# Altium project Window Comparator - OVP & UVP.PrjPcb
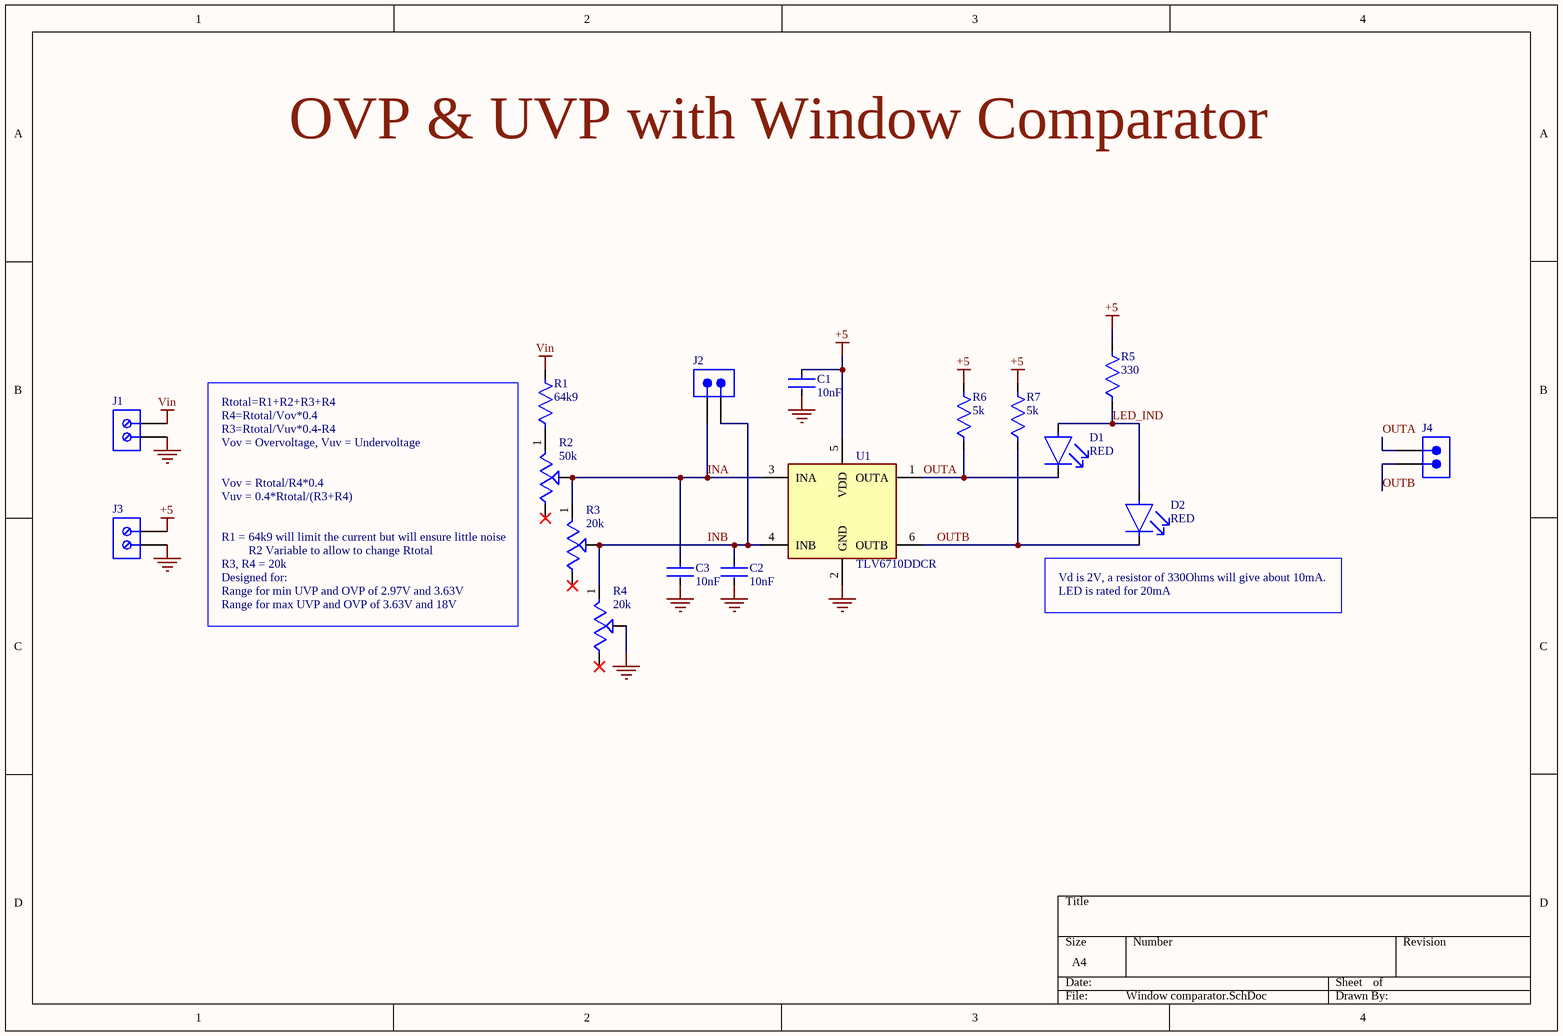
[diagram p0: Window comparator.SchDoc]
1 sheet, 17 parts. Net scope: global (net labels, ports and power ports of the same name join across sheets).
Board file: Window Comparator.PcbDoc

## Sheet Window comparator.SchDoc
size A4; SheetNumber: 1; SheetTotal: 1

### Parts
C1  10nF  [C0805]
C2  10nF  [C0805]
C3  10nF  [C0805]
D1  RED  [LED RED]
D2  RED  [LED RED]
J1  691137710002  [Wire terminal]  (value not drawn)
J2  61300211121  [Pin connector]  (value not drawn)
J3  691137710002  [Wire terminal]  (value not drawn)
J4  61300211121  [Pin connector]  (value not drawn)
R1  64k9  [R0805]
R2  50k  [TS63Y Trimmer]
R3  20k  [TS63Y Trimmer]
R4  20k  [TS63Y Trimmer]
R5  330  [R0805]
R6  5k  [R0805]
R7  5k  [R0805]
U1  TLV6710DDCR  [TLV6710DDCR]

### Nets
+5: C1.1 J3.2 R5.2 R6.2 R7.2 U1.5(VDD)
GND: C1.2 C2.2 C3.2 J1.1 J3.1 R4.2(B) U1.2(GND)
Vin: J1.2 R1.2
INA: C3.1 J2.1 R2.2(B) R3.1(A) U1.3(INA)
INB: C2.1 J2.2 R3.2(B) R4.1(A) U1.4(INB)
LED_IND: D1.2(A) D2.2(A) R5.1
OUTA: D1.1(C) J4.1 R6.1 U1.1(OUTA)
OUTB: D2.1(C) J4.2 R7.1 U1.6(OUTB)
NetR1_1: R1.1 R2.1(A)

Not connected (* = marked no-connect by the designer): R2 3(C)*; R3 3(C)*; R4 3(C)*

### Notes on the sheet
- OVP & UVP with Window Comparator
- Rtotal=R1+R2+R3+R4
- R4=Rtotal/Vov*0.4
- Vov = Overvoltage, Vuv = Undervoltage
- R3=Rtotal/Vuv*0.4-R4
- Vov = Rtotal/R4*0.4
- Vuv = 0.4*Rtotal/(R3+R4)
- (near R3) R1 = 64k9 will limit the current but will ensure little noise
- R3, R4 = 20k
- Designed for:
- R2 Variable to allow to change Rtotal
- (near D2) Vd is 2V, a resistor of 330Ohms will give about 10mA.
- Range for min UVP and OVP of 2.97V and 3.63V
- Range for max UVP and OVP of 3.63V and 18V
- LED is rated for 20mA

### Library data of the parts
C1-C3 = C0805C103K5RECAUTO: Ceramic Capacitor, Multilayer, Ceramic, 50V, 10% +Tol, 10% -Tol, X7R, 15% TC, 0.01uF, Surface Mount, 0805; Manufacturer: KEMET; Supplier: Newark; Supplier Part Number: 76AH8705; Manufacturer Part Number: C0805C103K5RECAUTO; RoHS: Yes; Category: Ceramic Capacitors; Stock: 500; Pricing: 1=0.015, 25=0.015, 50=0.015 (USD); Pins: 2; Dielectric Material: Ceramic; Capacitor Type: Ceramic; Reach SVHC Compliant: Yes; RoHS Compliant: Yes; ComponentLink1URL: https://datasheet.ciiva.com:443/pdfs/VipMasterIC/IC/KEME/KEME-S-A0008958450/KEME-S-A0008958450-1.pdf?src-supplier=IHS+Markit; ComponentLink1Description: https://datasheet.ciiva.com:443/pdfs/VipMasterIC/IC/KEME/KEME-S-A0008958450/KEME-S-A0008958450-1.pdf?src-supplier=IHS+Markit; ComponentLink2URL: http://www.farnell.com/datasheets/2723804.pdf?src-supplier=Farnell; ComponentLink2Description: http://www.farnell.com/datasheets/2723804.pdf?src-supplier=Farnell; ComponentLink3URL: https://api.kemet.com/component-edge/download/datasheet/C0805C103K5RECAUTO.pdf?src-supplier=Digikey; ComponentLink3Description: https://api.kemet.com/component-edge/download/datasheet/C0805C103K5RECAUTO.pdf?src-supplier=Digikey; ComponentLink4URL: http://www.farnell.com/datasheets/2723804.pdf?src-supplier=Newark; ComponentLink4Description: http://www.farnell.com/datasheets/2723804.pdf?src-supplier=Newark
D1 D2 = VLMS1300-GS08: Single Color LED, Super Red, 1.1mm; Manufacturer: Vishay Semiconductors; Shape: Rectangular; Additional Feature: HIGH RELIABILITY; Forward Current: 30mA; Forward Voltage: 2.4V; Luminous Intensity-Nom: 54mcd; Channels: 1; Reverse Voltage-Max: 5V; Viewing Angle: 130°; Overall Height: 0.8mm; Supplier: Mouser; Supplier Part Number: 78-VLMS1300-GS08; Manufacturer Part Number: VLMS1300-GS08; RoHS: Yes; Category: LEDs; Stock: 39915; Pricing: 1=0.27, 10=0.217, 50=0.217, 100=0.091, 1000=0.075, 10000=0.052 (USD); Mounting Technology: Surface Mount; Pins: 2; Color: Red; Color@wavelength: Red; Min Operating Temperature: -35°C; Max Operating Temperature: 85°C; Optoelectronic Device Type: SINGLE COLOR LED; Packaging: Tape and Reel; Size: 1.1mm; Terminal Pitch: 1.5mm; Reach SVHC Compliant: Yes; RoHS Compliant: Yes; ComponentLink1URL: https://datasheet.ciiva.com:443/pdfs/VipMasterIC/IC/VISH/VISH-S-A0004564149/VISH-S-A0004564149-1.pdf?src-supplier=IHS+Markit; ComponentLink1Description: https://datasheet.ciiva.com:443/pdfs/VipMasterIC/IC/VISH/VISH-S-A0004564149/VISH-S-A0004564149-1.pdf?src-supplier=IHS+Markit; ComponentLink2URL: https://datasheet.ciiva.com/26322/vlmo1300-26322153.pdf?src-supplier=Element14; ComponentLink2Description: https://datasheet.ciiva.com/26322/vlmo1300-26322153.pdf?src-supplier=Element14; ComponentLink3URL: https://datasheet.ciiva.com/8028/vlmo1300-8028047.pdf?src-supplier=Element14; ComponentLink3Description: https://datasheet.ciiva.com/8028/vlmo1300-8028047.pdf?src-supplier=Element14; ComponentLink4URL: https://datasheet.ciiva.com/9333/vlmo1300-9333743.pdf?src-supplier=Avnet; ComponentLink4Description: https://datasheet.ciiva.com/9333/vlmo1300-9333743.pdf?src-supplier=Avnet; ComponentLink5URL: https://datasheet.ciiva.com/16510/vlmo1300-16510985.pdf?src-supplier=Future+Electronics; ComponentLink5Description: https://datasheet.ciiva.com/16510/vlmo1300-16510985.pdf?src-supplier=Future+Electronics
J1 J3 = 691137710002: Barrier Strip Terminal Block; Manufacturer: Wurth Electronics; Supplier: Rs; Supplier Part Number: 1770020; Manufacturer Part Number: 691137710002; RoHS: No; Category: Terminal Blocks; Stock: 15; Pricing: 5=0.374, 25=0.336, 50=0.306, 100=0.28, 250=0.26 (EUR); RoHS Compliant: Yes; ComponentLink1URL: https://datasheet.ciiva.com:443/pdfs/VipMasterIC/IC/MIDC/MIDC-S-A0005074262/MIDC-S-A0004711666-1.pdf?src-supplier=IHS+Markit; ComponentLink1Description: https://datasheet.ciiva.com:443/pdfs/VipMasterIC/IC/MIDC/MIDC-S-A0005074262/MIDC-S-A0004711666-1.pdf?src-supplier=IHS+Markit; ComponentLink2URL: https://katalog.we-online.de/em/datasheet/691137710002.pdf?src-supplier=Digikey; ComponentLink2Description: https://katalog.we-online.de/em/datasheet/691137710002.pdf?src-supplier=Digikey
J2 J4 = 61300211121: Board Connector, 2 Contact(s), 1 Row(s), Male, Straight, 0.1 inch Pitch, Solder Terminal, Locking, Black Insulator, Plug; Manufacturer: Wurth Electronics; Option: General Purpose; Contact Pattern: RECTANGULAR; Contact Resistance: 20mR; Contact Style: SQ PIN-SKT; Dielectric Withstanding Voltage (AC): 500V; Filter Feature: No; Insulation Resistance: 1GR; Number Of Connectors: 1; Rated Current (Signal): 3A; Number of Contacts: 2; Body Length: 0.2inch; Reference Standard: UL; Reliability: COMMERCIAL; Supplier: Rs; Supplier Part Number: 1725138; Manufacturer Part Number: 61300211121; RoHS: Yes; Category: Headers and Wire Housings; Stock: 2265; Pricing: 1000=0.063 (EUR); Mounting Technology: Board; Contact Material: Copper Alloy; Contact Finish - Mating: GOLD; Contact Finish - Termination: Gold (Au) - with Nickel (Ni) barrier; Insulation Color: Black; Insulation Material: Polybutylene; Min Operating Temperature: -40°C; Max Operating Temperature: 125°C; Connector Type: BOARD CONNECTOR; JESD-609 Code: e4; Body/Shell Style: PLUG; Contact Gender: Male; Mixed Contacts: No; Mounting Style: STRAIGHT; Number of Rows Loaded: 1; PCB Contact Pattern: RECTANGULAR; Termination: Solder; Body Breadth: 0.1inch; Body Depth: 0.1inch; Mating Contact Pitch: 0.1inch; Mounting Option 1: LOCKING; Terminal Length: 0.118inch; Terminal Pitch: 2.54mm; Flammability Rating: UL94 V-0; Reach SVHC Compliant: Yes; RoHS Compliant: Yes; DIN Conformance: No; IEC Conformance: No; MIL Conformance: No; ComponentLink1URL: https://datasheet.ciiva.com:443/pdfs/VipMasterIC/IC/MIDC/MIDCS07676/MIDCS07676-1.pdf?src-supplier=IHS+Markit; ComponentLink1Description: https://datasheet.ciiva.com:443/pdfs/VipMasterIC/IC/MIDC/MIDCS07676/MIDCS07676-1.pdf?src-supplier=IHS+Markit; ComponentLink2URL: https://datasheet.ciiva.com/13619/6130xx11121-48870-13619345.pdf?src-supplier=Mouser; ComponentLink2Description: https://datasheet.ciiva.com/13619/6130xx11121-48870-13619345.pdf?src-supplier=Mouser
R1 = CRCW080564K9FKEA: Fixed Resistor, Metal Glaze/thick Film, 0.125W, 64900ohm, 150V, 1% +/-Tol, 100ppm/Cel, Surface Mount, 0805; Manufacturer: Vishay; Power: 125mW; Rated Temperature: 70°C; Value: 64.9kR; Temperature Coefficient: 100ppm/°C; Package Height: 0.45mm; Package Length: 2mm; Package Width: 1.25mm; Reference Standard: AEC-Q200; Supplier: Future Electronics; Supplier Part Number: 5035246; Manufacturer Part Number: CRCW080564K9FKEA; RoHS: Yes; Category: Chip SMD Resistors; Stock: 15000; Pricing: 5000=0.0061, 20000=0.0059, 75000=0.0056, 150000=0.0055, 375000=0.0052 (USD); Mounting Technology: Surface Mount; Pins: 2; Package Shape: Rectangular; Case/Package: 0805; Terminal Finish: Nickel; Min Operating Temperature: -55°C; Max Operating Temperature: 155°C; Tolerance: 1%; JESD-609 Code: e3; Resistor Type: FIXED RESISTOR; Construction: Chip; Package Style: SMTMeter; Packaging: Tape and Reel; Technology: METAL GLAZE/THICK FILM; Termination: Wraparound; Working Voltage: 150V; Reach SVHC Compliant: Yes; RoHS Compliant: Yes; ComponentLink1URL: https://datasheet.ciiva.com:443/pdfs/VipMasterIC/IC/VISH/VISH-S-A0007266705/VISH-S-A0007266705-1.pdf?src-supplier=IHS+Markit; ComponentLink1Description: https://datasheet.ciiva.com:443/pdfs/VipMasterIC/IC/VISH/VISH-S-A0007266705/VISH-S-A0007266705-1.pdf?src-supplier=IHS+Markit; ComponentLink2URL: https://datasheet.ciiva.com/7726/66915-7726047.pdf?src-supplier=Element14; ComponentLink2Description: https://datasheet.ciiva.com/7726/66915-7726047.pdf?src-supplier=Element14; ComponentLink3URL: https://datasheet.ciiva.com/8994/dcrcwe3-8994359.pdf?src-supplier=Avnet; ComponentLink3Description: https://datasheet.ciiva.com/8994/dcrcwe3-8994359.pdf?src-supplier=Avnet; ComponentLink4URL: https://datasheet.ciiva.com/5547/dcrcwe3-109170-5547542.pdf?src-supplier=Mouser; ComponentLink4Description: https://datasheet.ciiva.com/5547/dcrcwe3-109170-5547542.pdf?src-supplier=Mouser; ComponentLink5URL: https://datasheet.ciiva.com/16776/70201119-16776154.pdf?src-supplier=Allied+Electronics; ComponentLink5Description: https://datasheet.ciiva.com/16776/70201119-16776154.pdf?src-supplier=Allied+Electronics; ComponentLink6URL: https://datasheet.ciiva.com/2495/dcrcwe3-2495968.pdf?src-supplier=Digikey; ComponentLink6Description: https://datasheet.ciiva.com/2495/dcrcwe3-2495968.pdf?src-supplier=Digikey; ComponentLink7URL: https://datasheet.ciiva.com/2495/dcrcwe3-2495969.pdf?src-supplier=Digikey; ComponentLink7Description: https://datasheet.ciiva.com/2495/dcrcwe3-2495969.pdf?src-supplier=Digikey; ComponentLink8URL: https://datasheet.ciiva.com/2495/dcrcwe3-2495970.pdf?src-supplier=Digikey; ComponentLink8Description: https://datasheet.ciiva.com/2495/dcrcwe3-2495970.pdf?src-supplier=Digikey
R2 = TS63Y503KR10: Trimmer, Cermet, 0.25W, 50000ohm, 112V, 10% +/-Tol, 100ppm/Cel, 14 Turn(s), 2720; Manufacturer: Vishay Sfernice; Actuator Orientation: Vertical; Actuator Type: SCREW; Ganging Number: 1; Number of Turns: 14; Power: 250mW; Rated Temperature: 70°C; Value: 50kR; Resistance Law: Linear; Rotational Angle: 5040°; Temperature Coefficient: 100ppm/°C; Lead Diameter: 0.45mm; Package Height: 6.85mm; Package Width: 5mm; Supplier: Digikey; Supplier Part Number: TS63Y-50KTR-ND; Manufacturer Part Number: TS63Y503KR10; RoHS: Yes; Category: Variable Resistors and Potentiometers; Stock: 1000; Pricing: 500=2.7472, 1000=2.5755, 2500=2.4038 (USD); Mounting Technology: Surface Mount; Pins: 3; Case/Package: 2720; Terminal Finish: Tin; Min Operating Temperature: -55°C; Max Operating Temperature: 155°C; Tolerance: 10%; JESD-609 Code: e3; Resistor Type: TRIMMER; Construction: Rectangular; Package Style: SMTMeter; Packaging: Tape and Reel; Technology: CERMET; Termination: Wire; Working Voltage: 112V; Package Length: 6.85mm; RoHS Compliant: Yes; Reach SVHC Compliant: No; ComponentLink1URL: https://datasheet.ciiva.com:443/pdfs/VipMasterIC/IC/VISH/VISH-S-A0006600877/VISH-S-A0006600877-1.pdf?src-supplier=IHS+Markit; ComponentLink1Description: https://datasheet.ciiva.com:443/pdfs/VipMasterIC/IC/VISH/VISH-S-A0006600877/VISH-S-A0006600877-1.pdf?src-supplier=IHS+Markit; ComponentLink2URL: https://datasheet.ciiva.com/2156/ts63-2156492.pdf?src-supplier=Digikey; ComponentLink2Description: https://datasheet.ciiva.com/2156/ts63-2156492.pdf?src-supplier=Digikey; ComponentLink3URL: https://datasheet.ciiva.com/16716/70218793-16716796.pdf?src-supplier=Allied+Electronics; ComponentLink3Description: https://datasheet.ciiva.com/16716/70218793-16716796.pdf?src-supplier=Allied+Electronics; ComponentLink4URL: https://datasheet.ciiva.com/2156/ts63-2156493.pdf?src-supplier=Digikey; ComponentLink4Description: https://datasheet.ciiva.com/2156/ts63-2156493.pdf?src-supplier=Digikey; ComponentLink5URL: https://datasheet.ciiva.com/2156/ts63-2156494.pdf?src-supplier=Digikey; ComponentLink5Description: https://datasheet.ciiva.com/2156/ts63-2156494.pdf?src-supplier=Digikey; ComponentLink6URL: https://datasheet.ciiva.com/8697/ts63-8697838.pdf?src-supplier=Avnet; ComponentLink6Description: https://datasheet.ciiva.com/8697/ts63-8697838.pdf?src-supplier=Avnet
R3 R4 = TS63Y203KR10: Trimmer, Cermet, 0.25W, 20000ohm, 70.7V, 10% +/-Tol, 100ppm/Cel, 14 Turn(s), 2720; Manufacturer: Vishay Sfernice; Actuator Orientation: Vertical; Actuator Type: SCREW; Ganging Number: 1; Number of Turns: 14; Power: 250mW; Rated Temperature: 70°C; Value: 20kR; Resistance Law: Linear; Rotational Angle: 5040°; Temperature Coefficient: 100ppm/°C; Lead Diameter: 0.45mm; Package Height: 6.85mm; Package Width: 5mm; Supplier: Digikey; Supplier Part Number: TS63Y-20KTR-ND; Manufacturer Part Number: TS63Y203KR10; RoHS: Yes; Category: Variable Resistors and Potentiometers; Stock: 1500; Pricing: 500=2.7472, 1000=2.5755, 2500=2.4038 (USD); Mounting Technology: Surface Mount; Pins: 3; Case/Package: 2720; Terminal Finish: Tin; Min Operating Temperature: -55°C; Max Operating Temperature: 155°C; Tolerance: 10%; JESD-609 Code: e3; Resistor Type: TRIMMER; Construction: Rectangular; Package Style: SMTMeter; Packaging: Tape and Reel; Technology: CERMET; Termination: Wire; Working Voltage: 70.7V; Package Length: 6.85mm; Reach SVHC Compliant: No; RoHS Compliant: Yes; ComponentLink1URL: https://datasheet.ciiva.com:443/pdfs/VipMasterIC/IC/VISH/VISH-S-A0006600877/VISH-S-A0006600877-1.pdf?src-supplier=IHS+Markit; ComponentLink1Description: https://datasheet.ciiva.com:443/pdfs/VipMasterIC/IC/VISH/VISH-S-A0006600877/VISH-S-A0006600877-1.pdf?src-supplier=IHS+Markit; ComponentLink2URL: https://datasheet.ciiva.com/2156/ts63-2156501.pdf?src-supplier=Digikey; ComponentLink2Description: https://datasheet.ciiva.com/2156/ts63-2156501.pdf?src-supplier=Digikey; ComponentLink3URL: https://datasheet.ciiva.com/2156/ts63-2156502.pdf?src-supplier=Digikey; ComponentLink3Description: https://datasheet.ciiva.com/2156/ts63-2156502.pdf?src-supplier=Digikey; ComponentLink4URL: https://datasheet.ciiva.com/2156/ts63-2156503.pdf?src-supplier=Digikey; ComponentLink4Description: https://datasheet.ciiva.com/2156/ts63-2156503.pdf?src-supplier=Digikey; ComponentLink5URL: https://datasheet.ciiva.com/16716/70218793-16716461.pdf?src-supplier=Allied+Electronics; ComponentLink5Description: https://datasheet.ciiva.com/16716/70218793-16716461.pdf?src-supplier=Allied+Electronics
R5 = CRCW0805330RJNEAC: Fixed Resistor, Metal Glaze/thick Film, 0.125W, 330ohm, 150V, 5% +/-Tol, 200ppm/Cel, Surface Mount, 0805; Manufacturer: Vishay; Power: 125mW; Value: 330R; Temperature Coefficient: -200200ppm/°C; Package Height: 0.5mm; Package Length: 2mm; Package Width: 1.25mm; Supplier: Digikey; Supplier Part Number: 541-4168-2-ND; Manufacturer Part Number: CRCW0805330RJNEAC; RoHS: Yes; Category: Chip SMD Resistors; Stock: 330000; Pricing: 5000=0.00613, 10000=0.00544, 25000=0.00472, 35000=0.0046, 50000=0.00428, 125000=0.00391 (USD); Pins: 2; Case/Package: 0805; Terminal Finish: Nickel; Min Operating Temperature: -55°C; Max Operating Temperature: 155°C; Tolerance: 5%; JESD-609 Code: e3; Resistor Type: FIXED RESISTOR; Construction: Chip; Package Style: SMTMeter; Packaging: Tape and Reel; Technology: METAL GLAZE/THICK FILM; Working Voltage: 150V; Reach SVHC Compliant: Yes; RoHS Compliant: Yes; ComponentLink1URL: https://datasheet.ciiva.com:443/pdfs/VipMasterIC/IC/VISH/VISH-S-A0003599164/VISH-S-A0003599164-1.pdf?src-supplier=IHS+Markit; ComponentLink1Description: https://datasheet.ciiva.com:443/pdfs/VipMasterIC/IC/VISH/VISH-S-A0003599164/VISH-S-A0003599164-1.pdf?src-supplier=IHS+Markit; ComponentLink2URL: http://www.vishay.com/docs/28773/crcwce3.pdf?src-supplier=Digikey; ComponentLink2Description: http://www.vishay.com/docs/28773/crcwce3.pdf?src-supplier=Digikey
R6 R7 = CRCW08055K00JNTA: SMD Chip Resistor, 5 kOhm, ± 5%, 125 mW, 0805 [2012 Metric], Thick Film, General Purpose; Manufacturer: Vishay; Power: 125mW; Rated Temperature: 70°C; Value: 5kR; Temperature Coefficient: 200ppm/°C; Working Voltage: 150V; Reference Standard: AEC-Q200; Supplier: Farnell; Supplier Part Number: 3975011RL; Manufacturer Part Number: CRCW08055K00JNTA; Category: Chip SMD Resistors; Stock: 3610; Pricing: 500=0.035, 1000=0.02, 2500=0.019, 5000=0.018, 25000=0.017, 50000=0.016 (EUR); Mounting Technology: Surface Mount; Pins: 2; Package Shape: Rectangular; Case/Package: 0805; Terminal Finish: Nickel; Min Operating Temperature: -55°C; Max Operating Temperature: 155°C; Tolerance: 5%; JESD-609 Code: e0; Resistor Type: FIXED RESISTOR; Packaging: Tape and Reel; Technology: METAL GLAZE/THICK FILM; Termination: Wraparound; RoHS Compliant: No; Reach SVHC Compliant: No; ComponentLink1URL: https://datasheet.ciiva.com:443/pdfs/VipMasterIC/IC/VISH/VISHS17577/VISHS17577-1.pdf?src-supplier=IHS+Markit; ComponentLink1Description: https://datasheet.ciiva.com:443/pdfs/VipMasterIC/IC/VISH/VISHS17577/VISHS17577-1.pdf?src-supplier=IHS+Markit; ComponentLink2URL: http://www.mouser.com/ds/2/427/dcrcw-72725.pdf?src-supplier=Mouser; ComponentLink2Description: http://www.mouser.com/ds/2/427/dcrcw-72725.pdf?src-supplier=Mouser; ComponentLink3URL: http://www.vishay.com/docs/20008/dcrcw.pdf?src-supplier=Digikey; ComponentLink3Description: http://www.vishay.com/docs/20008/dcrcw.pdf?src-supplier=Digikey; ComponentLink4URL: https://datasheet.octopart.com/CRCW08055K00JNTA-Vishay-datasheet-137115208.pdf?src-supplier=X-ON; ComponentLink4Description: https://datasheet.octopart.com/CRCW08055K00JNTA-Vishay-datasheet-137115208.pdf?src-supplier=X-ON; ComponentLink5URL: https://datasheet.octopart.com/CRCW08055K00JNTA-Vishay-datasheet-62316123.pdf?src-supplier=Future+Electronics; ComponentLink5Description: https://datasheet.octopart.com/CRCW08055K00JNTA-Vishay-datasheet-62316123.pdf?src-supplier=Future+Electronics; ComponentLink6URL: https://datasheet.octopart.com/D-CRCW-Lead-%28Pb%29-Bearing-Thick-Film%2C-Rectangular-Chip-Resistors-Vishay-datasheet-family-72.pdf; ComponentLink6Description: https://datasheet.octopart.com/D-CRCW-Lead-%28Pb%29-Bearing-Thick-Film%2C-Rectangular-Chip-Resistors-Vishay-datasheet-family-72.pdf; ComponentLink7URL: https://datasheet.octopart.com/CRCW08055K00JNTA-Vishay-datasheet-13242068.pdf; ComponentLink7Description: https://datasheet.octopart.com/CRCW08055K00JNTA-Vishay-datasheet-13242068.pdf; ComponentLink8URL: https://datasheet.octopart.com/CRCW08055K00JNTA-Vishay-datasheet-13195083.pdf; ComponentLink8Description: https://datasheet.octopart.com/CRCW08055K00JNTA-Vishay-datasheet-13195083.pdf; ComponentLink9URL: https://datasheet.octopart.com/CRCW08055K00JNTA-Vishay-datasheet-13034211.pdf; ComponentLink9Description: https://datasheet.octopart.com/CRCW08055K00JNTA-Vishay-datasheet-13034211.pdf; ComponentLink10URL: https://datasheet.octopart.com/CRCW08055K00JNTA-Vishay-datasheet-12600034.pdf; ComponentLink10Description: https://datasheet.octopart.com/CRCW08055K00JNTA-Vishay-datasheet-12600034.pdf; ComponentLink11URL: https://datasheet.octopart.com/CRCW08055K00JNTA-Vishay-datasheet-12532161.pdf; ComponentLink11Description: https://datasheet.octopart.com/CRCW08055K00JNTA-Vishay-datasheet-12532161.pdf; ComponentLink12URL: https://datasheet.octopart.com/CRCW08055K00JNTA-Vishay-datasheet-12517896.pdf; ComponentLink12Description: https://datasheet.octopart.com/CRCW08055K00JNTA-Vishay-datasheet-12517896.pdf; ComponentLink13URL: https://datasheet.octopart.com/CRCW08055K00JNTA-Vishay-datasheet-12509762.pdf; ComponentLink13Description: https://datasheet.octopart.com/CRCW08055K00JNTA-Vishay-datasheet-12509762.pdf; ComponentLink14URL: https://datasheet.octopart.com/CRCW08055K00JNTA-Vishay-datasheet-10322335.pdf; ComponentLink14Description: https://datasheet.octopart.com/CRCW08055K00JNTA-Vishay-datasheet-10322335.pdf; ComponentLink15URL: https://datasheet.octopart.com/CRCW08055K00JNTA-Vishay-datasheet-8788789.pdf; ComponentLink15Description: https://datasheet.octopart.com/CRCW08055K00JNTA-Vishay-datasheet-8788789.pdf; ComponentLink16URL: https://datasheet.octopart.com/CRCW08055K00JNTA-Vishay-datasheet-8361388.pdf; ComponentLink16Description: https://datasheet.octopart.com/CRCW08055K00JNTA-Vishay-datasheet-8361388.pdf; ComponentLink17URL: https://datasheet.octopart.com/CRCW08055K00JNTA-Vishay-datasheet-5306405.pdf; ComponentLink17Description: https://datasheet.octopart.com/CRCW08055K00JNTA-Vishay-datasheet-5306405.pdf; ComponentLink18URL: https://datasheet.octopart.com/CRCW08055K00JNTA-Vishay-datasheet-546287.pdf; ComponentLink18Description: https://datasheet.octopart.com/CRCW08055K00JNTA-Vishay-datasheet-546287.pdf
U1 = TLV6710DDCR: Comparator, 2 Func, 2000uV Offset-Max, 28100ns Response Time, PDSO6; Manufacturer: Texas Instruments; JESD-609 Code: e4; Amplifier Type: COMPARATOR; Moisture Sensitivity Level: 2; Reach SVHC Compliant: Yes; RoHS Compliant: Yes; ComponentLink1URL: https://www.ti.com:443/lit/ds/symlink/tlv6710.pdf?src-supplier=IHS+Markit; ComponentLink1Description: https://www.ti.com:443/lit/ds/symlink/tlv6710.pdf?src-supplier=IHS+Markit; ComponentLink2URL: http://www.ti.com/general/docs/suppproductinfo.tsp?distId=10&amp;gotoUrl=http%3A%2F%2Fwww.ti.com%2Flit%2Fgpn%2Ftlv6710&src-supplier=Digikey; ComponentLink2Description: http://www.ti.com/general/docs/suppproductinfo.tsp?distId=10&amp;gotoUrl=http%3A%2F%2Fwww.ti.com%2Flit%2Fgpn%2Ftlv6710&src-supplier=Digikey; Category: Amplifiers - Op Amps, Buffer, Instrumentation; Stock: 6000; Pricing: 3000=1.08, 6000=1.0352 (USD); Terminal Finish: Nickel; RoHS: Yes; Manufacturer Part Number: TLV6710DDCR; Supplier: Arrow Electronics; Supplier Part Number: TLV6710DDCR